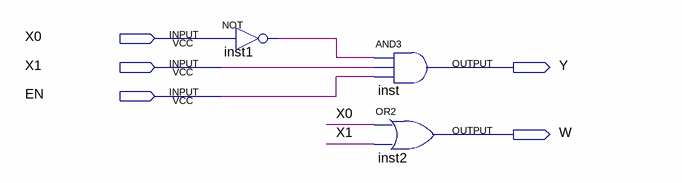
[diagram p0: schematic sheet]
// Quartus schematic CD2.bdf as structural Verilog: 3 symbols, 5 pins
module CD2 (
  input  X0,
  input  X1,
  input  EN,
  output Y,
  output W
);

  wire inst1_out;

  not inst1 (inst1_out, X0);
  and inst (Y, inst1_out, X1, EN);
  or inst2 (W, X0, X1);
endmodule
